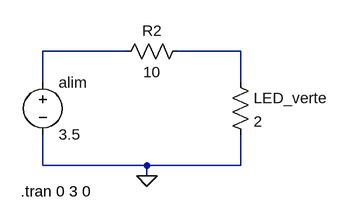
[diagram p0: schematic LED verte.asc]
LED verte.asc, the LTspice schematic file:
Version 4
SHEET 1 880 680
WIRE 144 48 16 48
WIRE 320 48 224 48
WIRE 16 96 16 48
WIRE 320 96 320 48
WIRE 16 224 16 176
WIRE 176 224 16 224
WIRE 320 224 320 176
WIRE 320 224 176 224
WIRE 176 240 176 224
FLAG 176 240 0
SYMBOL voltage 16 80 R0
SYMATTR InstName alim
SYMATTR Value 3.5
SYMBOL res 304 80 R0
SYMATTR InstName LED_verte
SYMATTR Value 2
SYMBOL res 240 32 R90
WINDOW 0 0 56 VBottom 2
WINDOW 3 32 56 VTop 2
SYMATTR InstName R2
SYMATTR Value 10
TEXT -18 264 Left 2 !.tran 0 3 0

The netlist it stands for:
* LED verte.asc
V§alim N001 0 3.5
R§LED_verte N002 0 2
R2 N002 N001 10
.tran 0 3 0
.backanno
.end